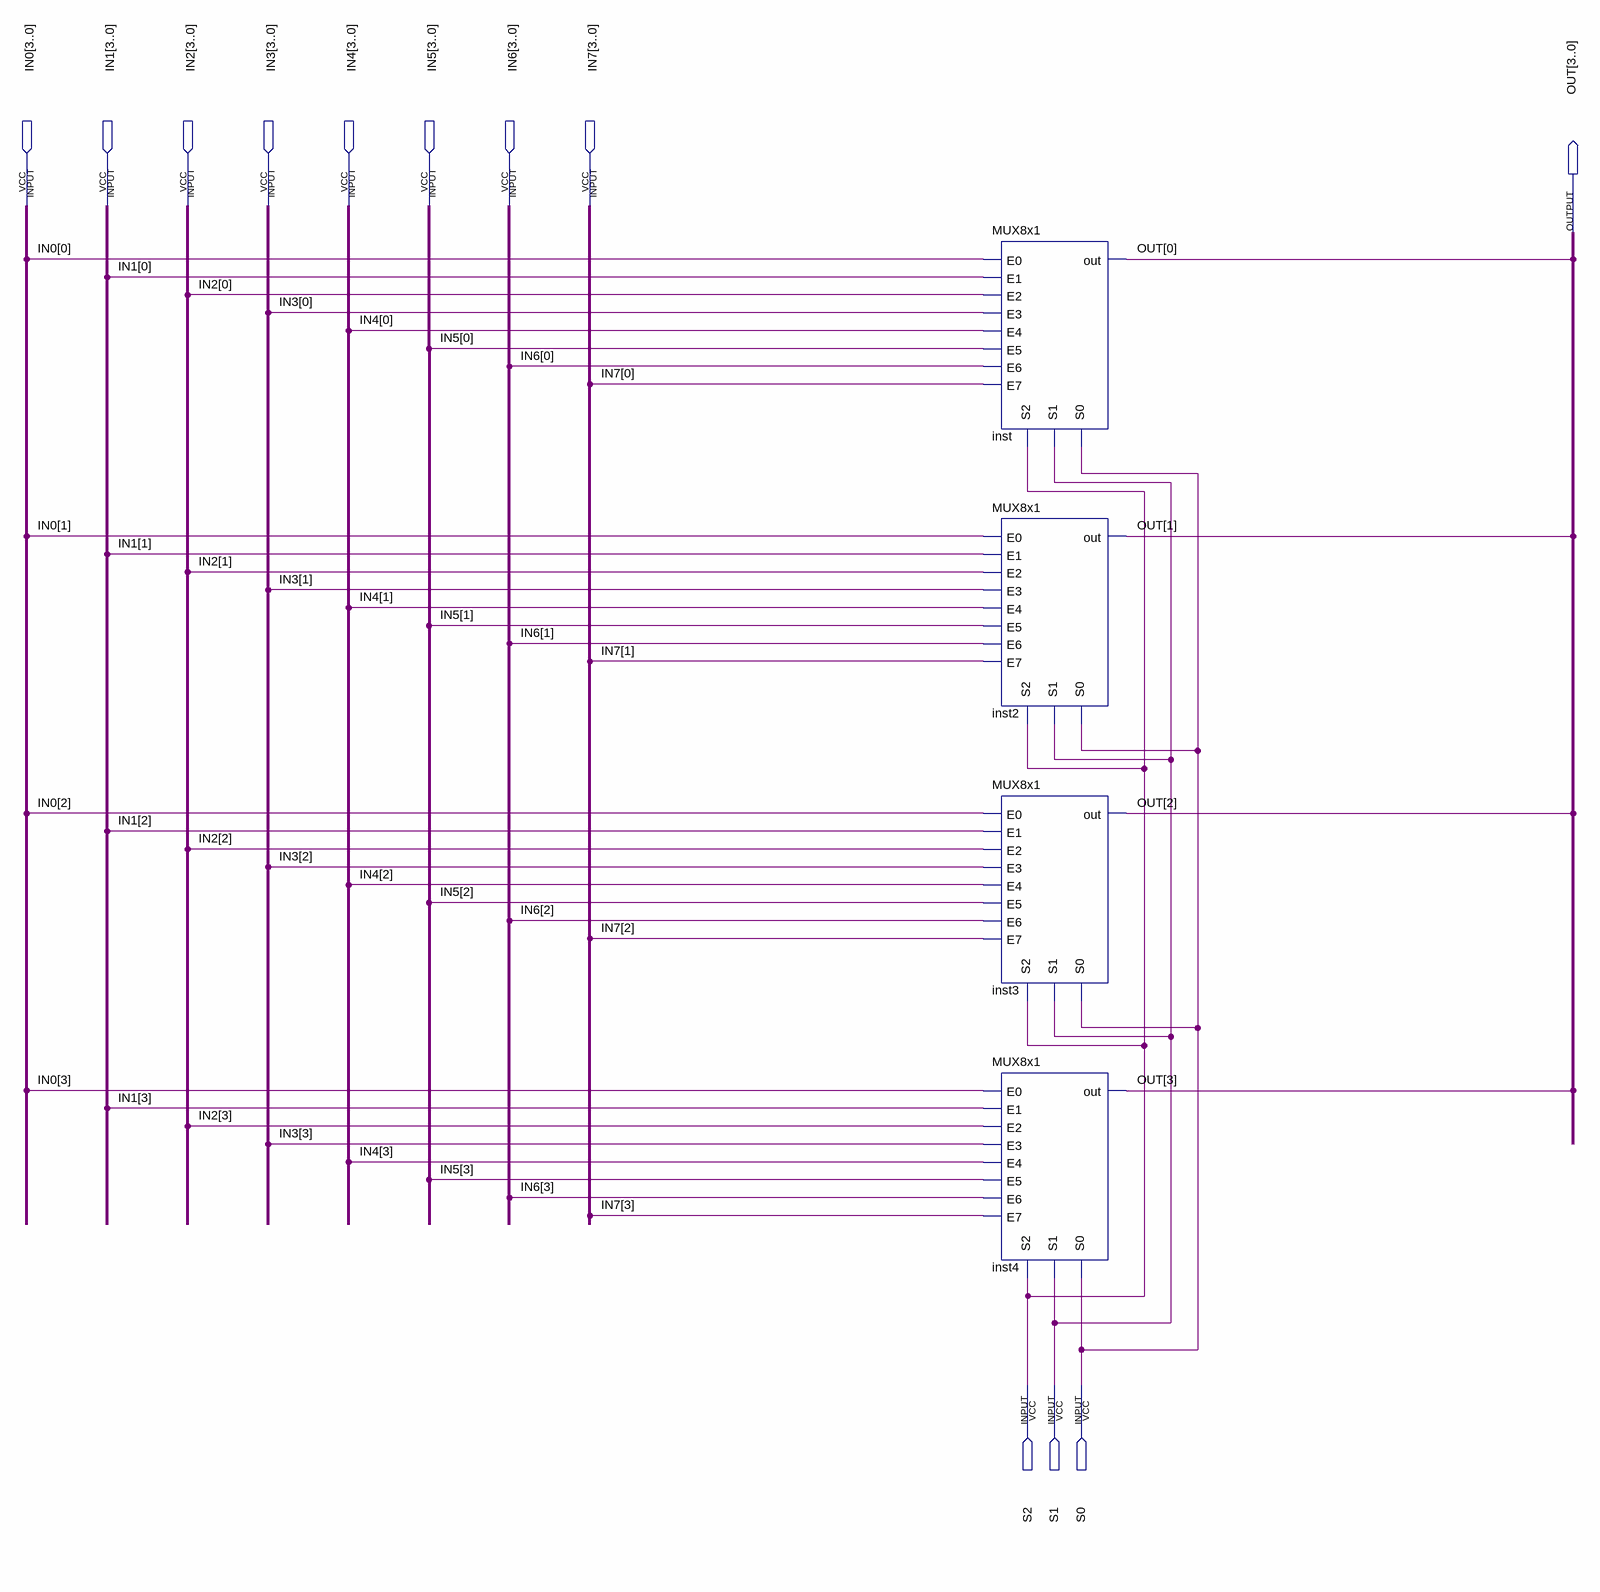
[diagram p0: schematic sheet]
// Quartus schematic MUX8x1Vector.bdf as structural Verilog: 4 symbols, 12 pins
module MUX8x1Vector (
  input  [3:0] IN0,
  input  [3:0] IN1,
  input  [3:0] IN2,
  input  [3:0] IN3,
  input  [3:0] IN4,
  input  [3:0] IN5,
  input  [3:0] IN6,
  input  [3:0] IN7,
  input  S2,
  input  S1,
  input  S0,
  output [3:0] OUT
);

  MUX8x1 inst (
    .E0(IN0[0]), .E1(IN1[0]), .E2(IN2[0]), .E3(IN3[0]), .E4(IN4[0]), .E5(IN5[0]), .E6(IN6[0]), .E7(IN7[0]),
    .S0(S0), .S1(S1), .S2(S2), .out(OUT[0]));
  MUX8x1 inst2 (
    .E0(IN0[1]), .E1(IN1[1]), .E2(IN2[1]), .E3(IN3[1]), .E4(IN4[1]), .E5(IN5[1]), .E6(IN6[1]), .E7(IN7[1]),
    .S0(S0), .S1(S1), .S2(S2), .out(OUT[1]));
  MUX8x1 inst3 (
    .E0(IN0[2]), .E1(IN1[2]), .E2(IN2[2]), .E3(IN3[2]), .E4(IN4[2]), .E5(IN5[2]), .E6(IN6[2]), .E7(IN7[2]),
    .S0(S0), .S1(S1), .S2(S2), .out(OUT[2]));
  MUX8x1 inst4 (
    .E0(IN0[3]), .E1(IN1[3]), .E2(IN2[3]), .E3(IN3[3]), .E4(IN4[3]), .E5(IN5[3]), .E6(IN6[3]), .E7(IN7[3]),
    .S0(S0), .S1(S1), .S2(S2), .out(OUT[3]));
endmodule
